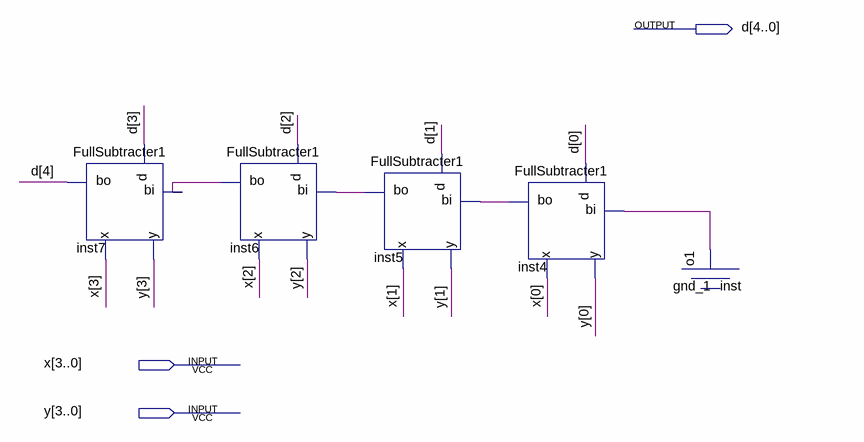
[diagram p0: schematic sheet]
// Quartus schematic FullSubtracter4.bdf as structural Verilog: 5 symbols, 3 pins
module FullSubtracter4 (
  input  [3:0] x,
  input  [3:0] y,
  output [4:0] d
);

  wire inst4_bo, inst5_bo, inst6_bo, inst_o1;

  FullSubtracter1 inst7 (.x(x[3]), .y(y[3]), .bi(inst6_bo), .d(d[3]), .bo(d[4]));
  FullSubtracter1 inst6 (.x(x[2]), .y(y[2]), .bi(inst5_bo), .d(d[2]), .bo(inst6_bo));
  FullSubtracter1 inst5 (.x(x[1]), .y(y[1]), .bi(inst4_bo), .d(d[1]), .bo(inst5_bo));
  FullSubtracter1 inst4 (.x(x[0]), .y(y[0]), .bi(inst_o1), .d(d[0]), .bo(inst4_bo));
  gnd_1 inst (.o1(inst_o1));
endmodule
